# EAGLE design sao-stripper (EAGLE 9.0.1)
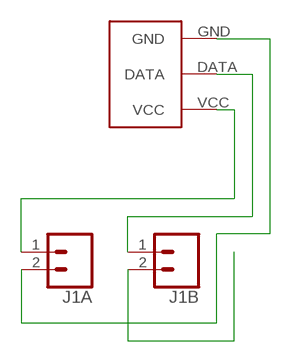
[diagram p0: schematic, sheet 1]

## Parts
J1A  CONN_02LOCK  [1X02_LOCK]
J1B  CONN_02LOCK  [1X02_LOCK]
U$1  LEDSTRIP  [LEDSTRIP]

## Nets
GND: J1A.2 U$1.GND
SCL: J1B.2
SDA: J1B.1 U$1.DATA
VCC: J1A.1 U$1.VCC

## Library data of the parts
J1A J1B = SparkFun-Connectors:CONN_02: Multi connection point. Often used as Generic Header-pin footprint for 0.1 inch spaced/style header connections On any of the 0.1 inch spaced packages, you can populate with these: Break Away Headers - Straight <https://www.sparkfun.com/products/116> (PRT-00116) Break Away Male Headers - Right Angle <https://www.sparkfun.com/products/553> (PRT-00553) Female Headers <https://www.sparkfun.com/products/115> (PRT-00115) Break Away Headers - Machine Pin <https://www.sparkfun.com/products/117> (PRT-00117) Break Away Female Headers - Swiss Machine Pin <https://www.sparkfun.com/products/743> (PRT-00743) For SCREWTERMINALS and SPRING TERMINALS visit here: Screw Terimnals on SparkFun.com <https://www.sparkfun.com/search/results?term=Screw+Terminals> (5mm/3.5mm/2.54mm spacing) This device is also useful as a general connection point to wire up your design to another part of your project. Our various solder wires solder well into these plated through hole pads. Hook-Up Wire - Assortment (Stranded, 22 AWG) <https://www.sparkfun.com/products/11375> (PRT-11375) Hook-Up Wire - Assortment (Solid Core, 22 AWG) <https://www.sparkfun.com/products/11367> (PRT-11367) View the entire wire category on our website here <https://www.sparkfun.com/categories/141> Special notes: Molex polarized connector foot print use with: PRT-08233 with associated crimp pins and housings. 2.54_SCREWTERM for use with PRT-10571. 3.5mm Screw Terminal footprints for PRT-08084 5mm Screw Terminal footprints for use with PRT-08432
U$1 = ledstrip:LEDSTRIP

## Board
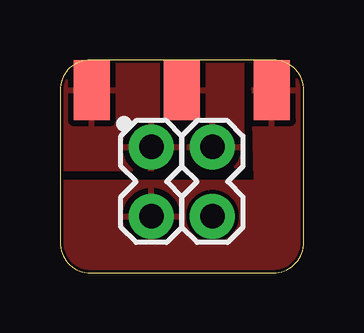
[diagram p1: board, top side]

Size 10.16 x 8.89 mm. Coordinates in mm from the lower left corner, seen from the top.
Outline: 0,7.62 0,1.27 arc90 1.27,0 8.89,0 arc90 10.16,1.27 10.16,7.62 arc90 8.89,8.89 1.27,8.89 arc90 0,7.62
Copper layers (1*16): Top 0.035mm / dielectric 1.5mm / Bottom 0.035mm
Design rules "default *": minimum track width 6mil, minimum drill 0.35mm, track to track 6mil, track to pad 6mil, pad to pad 6mil, via to via 6mil, smd to smd 6mil, copper to edge 5mil, drill to drill 6mil, minimum pad ring 10mil, minimum via ring 8mil, stop-mask expansion 4mil, vias tented up to drill 0mil, thermal gap 10mil

### Footprints (pad centres in the part's own frame; a part is rotated, then mirrored left to right if it is on the bottom)
1X02_LOCK = drill 1.016 pad 1.88: 1 -0.178,0; 2 2.718,0
LEDSTRIP = smd 2.5 x 1.5: DATA 0,0; GND 0,3.75; VCC 0,-3.75

### Placement (x,y rotation side)
J1A  3.81,5.08 270 top
J1B  6.35,5.08 270 top
U$1  5.08,7.62 270 top

### Tracks (layer width: path | path; a pad name or v marks a point on that pad's centre or on a via)
GND
  pour Top: 0.13,-0.76 0,3.81 8.13,3.81 8,8.89 11.18,8.89 11.18,3.81 11.3,-0.76
SDA
  pour Top: 7.62,4.45 7.62,8.89 5.33,8.89 5.33,4.45
VCC
  pour Top: 0.13,4.32 0,8.89 4.83,8.89 4.95,4.32

### Text on the board
tStop: D | + | - | @securelyfitz
bStop: git.io/sao-stripper